# Altium schematic sheet Controller Section.SchDoc
size A
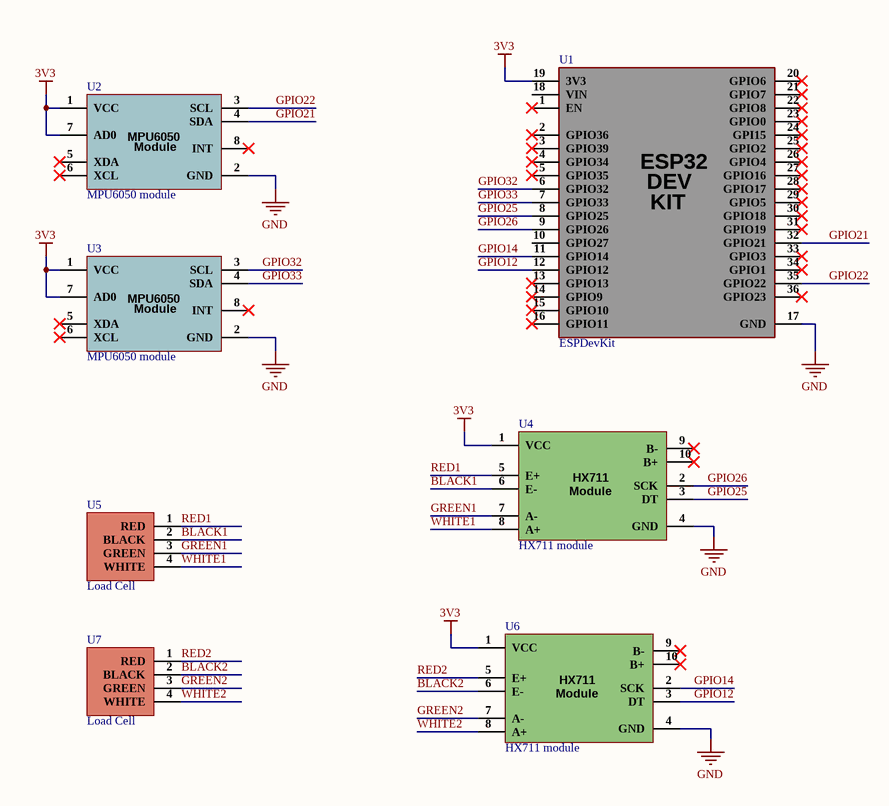
[diagram p0: Controller Section.SchDoc]

## Parts
U1  ESPDevKit
U2  MPU6050 module
U3  MPU6050 module
U4  HX711 module
U5  Load Cell
U6  HX711 module
U7  Load Cell

## Nets
3V3: U1.19(3V3) U2.1(VCC) U2.7(AD0) U3.1(VCC) U3.7(AD0) U4.1(VCC) U6.1(VCC)
GND: U1.17(GND) U2.2(GND) U3.2(GND) U4.4(GND) U6.4(GND)
BLACK1: U4.6(E-) U5.2(BLACK)
BLACK2: U6.6(E-) U7.2(BLACK)
GPIO12: U1.12(GPIO12) U6.3(DT)
GPIO14: U1.11(GPIO14) U6.2(SCK)
GPIO21: U1.32(GPIO21) U2.4(SDA)
GPIO22: U1.35(GPIO22) U2.3(SCL)
GPIO25: U1.8(GPIO25) U4.3(DT)
GPIO26: U1.9(GPIO26) U4.2(SCK)
GPIO32: U1.6(GPIO32) U3.3(SCL)
GPIO33: U1.7(GPIO33) U3.4(SDA)
GREEN1: U4.7(A-) U5.3(GREEN)
GREEN2: U6.7(A-) U7.3(GREEN)
RED1: U4.5(E+) U5.1(RED)
RED2: U6.5(E+) U7.1(RED)
WHITE1: U4.8(A+) U5.4(WHITE)
WHITE2: U6.8(A+) U7.4(WHITE)

Not connected (* = marked no-connect by the designer): U1 1(EN)* 2(GPIO36)* 3(GPIO39)* 4(GPIO34)* 5(GPIO35)* 10(GPIO27) 13(GPIO13)* 14(GPIO9)* 15(GPIO10)* 16(GPIO11)* 18(VIN) 20(GPIO6)* 21(GPIO7)* 22(GPIO8)* 23(GPIO0)* 24(GPI15)* 25(GPIO2)* 26(GPIO4)* 27(GPIO16)* 28(GPIO17)* 29(GPIO5)* 30(GPIO18)* 31(GPIO19)* 33(GPIO3)* 34(GPIO1)* 36(GPIO23)*; U2 5(XDA)* 6(XCL)* 8(INT)*; U3 5(XDA)* 6(XCL)* 8(INT)*; U4 9(B-)* 10(B+)*; U6 9(B-)* 10(B+)*

## Notes on the sheet
- (in symbol ESP Dev Kit) ESP32; DEV; KIT
- (in symbol HX711 module) HX711; Module
- (in symbol MPU6050 module) MPU6050; Module

## Library data of the parts
U1 = ESP Dev Kit